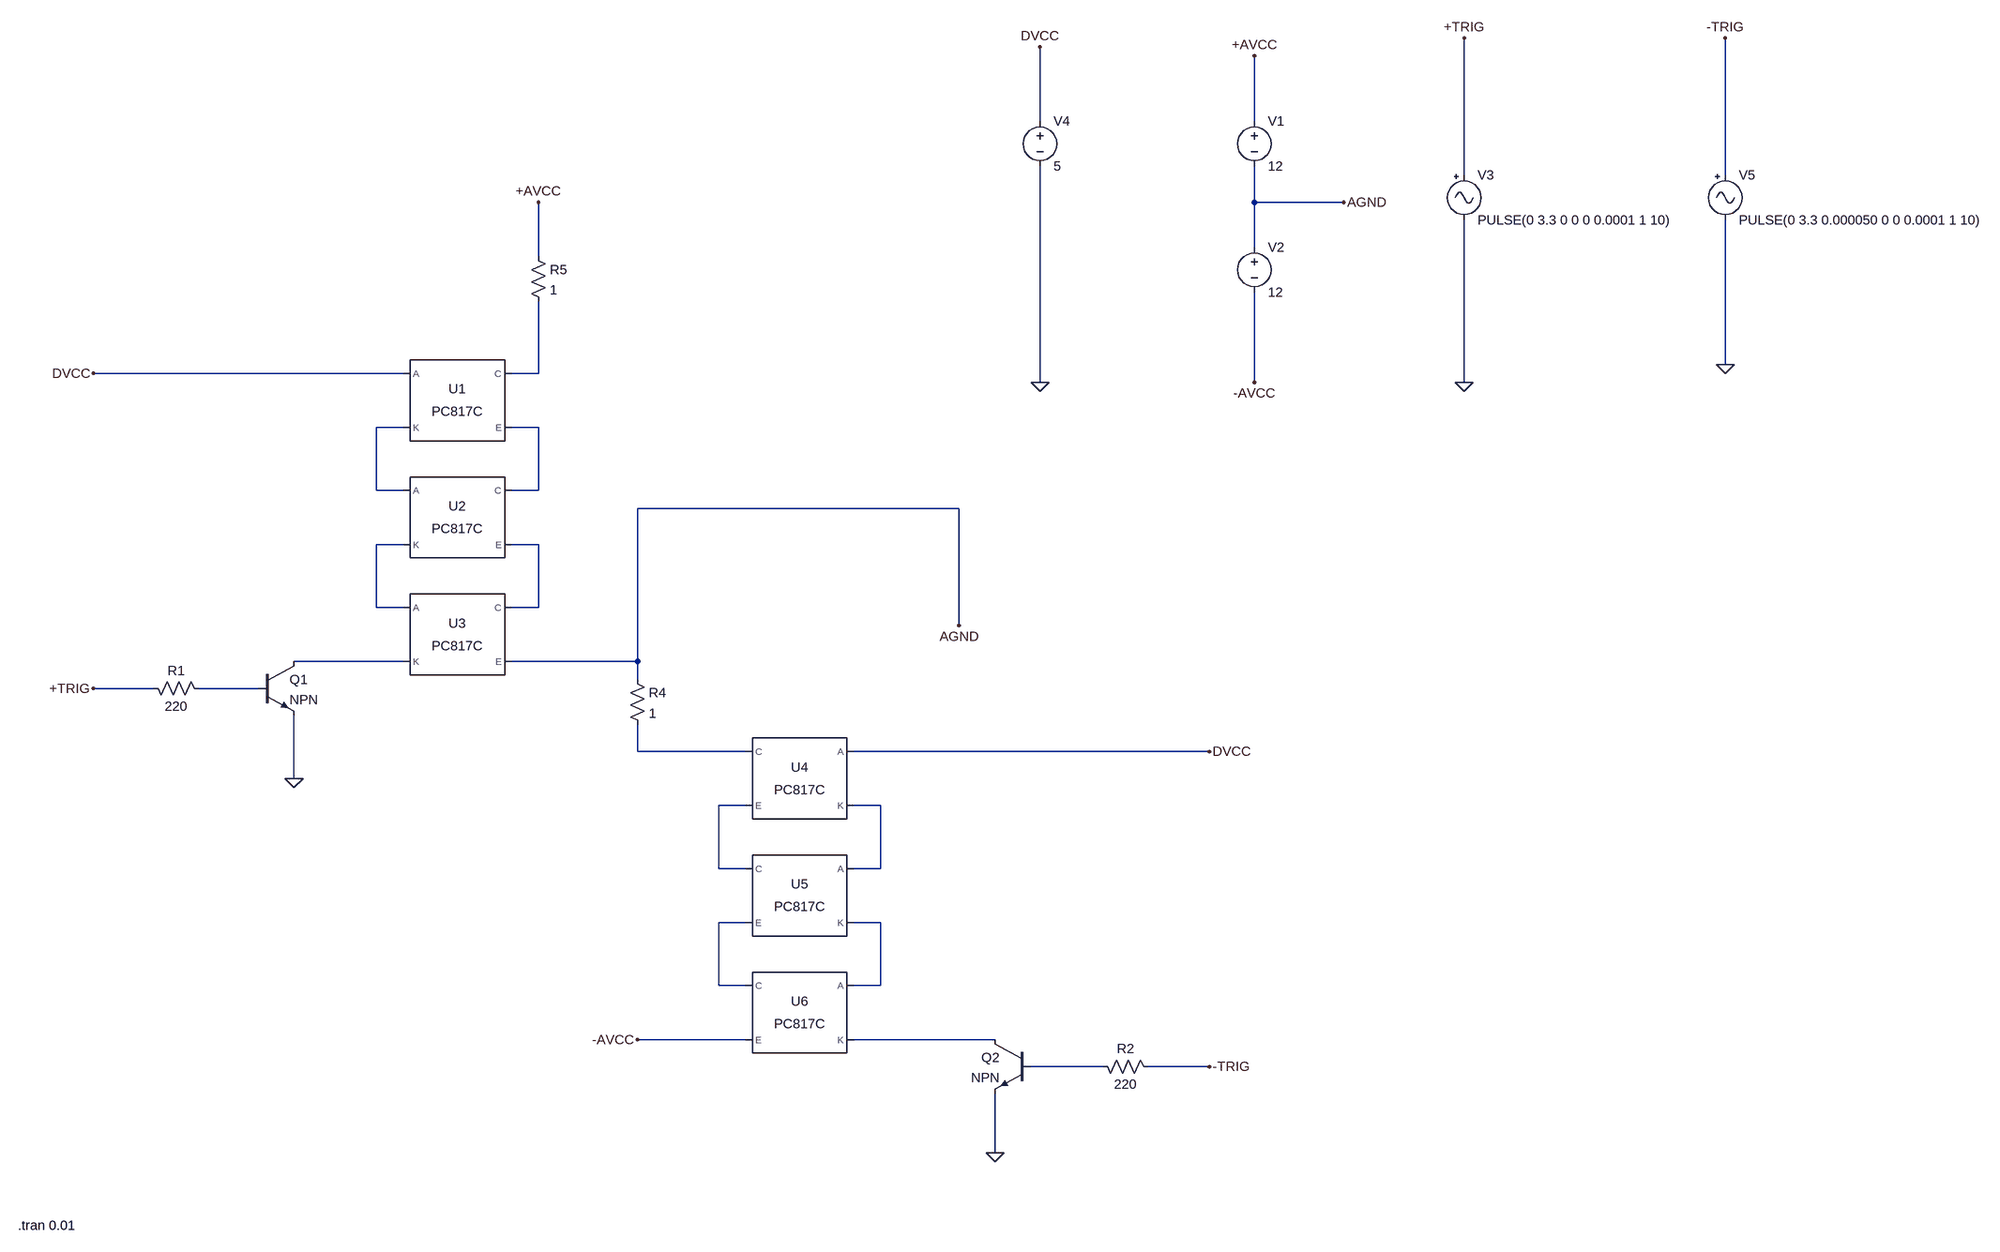
[diagram p0: schematic circuit_simulation.asc]
circuit_simulation.asc, the LTspice schematic file:
Version 4
SHEET 1 3124 1636
WIRE 1184 -352 1184 -496
WIRE 1600 -352 1600 -480
WIRE 2176 -256 2176 -512
WIRE 2640 -256 2640 -512
WIRE 1600 -208 1600 -272
WIRE 1824 -208 1600 -208
WIRE 1600 -128 1600 -208
WIRE 288 -112 288 -208
WIRE 2640 80 2640 -176
WIRE 48 96 -576 96
WIRE 288 96 288 -32
WIRE 288 96 240 96
WIRE 1184 112 1184 -272
WIRE 1600 112 1600 -48
WIRE 2176 112 2176 -176
WIRE 48 192 0 192
WIRE 288 192 240 192
WIRE 0 304 0 192
WIRE 48 304 0 304
WIRE 288 304 288 192
WIRE 288 304 240 304
WIRE 1040 336 464 336
WIRE 48 400 0 400
WIRE 288 400 240 400
WIRE 0 512 0 400
WIRE 48 512 0 512
WIRE 288 512 288 400
WIRE 288 512 240 512
WIRE 1040 544 1040 336
WIRE 48 608 -208 608
WIRE 464 608 464 336
WIRE 464 608 240 608
WIRE 464 640 464 608
WIRE -464 656 -576 656
WIRE -272 656 -384 656
WIRE 464 768 464 720
WIRE 656 768 464 768
WIRE 1520 768 848 768
WIRE -208 816 -208 704
WIRE 656 864 608 864
WIRE 896 864 848 864
WIRE 608 976 608 864
WIRE 656 976 608 976
WIRE 896 976 896 864
WIRE 896 976 848 976
WIRE 656 1072 608 1072
WIRE 896 1072 848 1072
WIRE 608 1184 608 1072
WIRE 656 1184 608 1184
WIRE 896 1184 896 1072
WIRE 896 1184 848 1184
WIRE 656 1280 464 1280
WIRE 1104 1280 848 1280
WIRE 1296 1328 1168 1328
WIRE 1520 1328 1376 1328
WIRE 1104 1488 1104 1376
FLAG 1520 768 DVCC
FLAG -576 96 DVCC
FLAG 288 -208 +AVCC
FLAG 464 1280 -AVCC
FLAG -576 656 +TRIG
FLAG 1520 1328 -TRIG
FLAG 1600 -480 +AVCC
FLAG 1600 112 -AVCC
FLAG 1824 -208 AGND
FLAG 1040 544 AGND
FLAG 2176 112 0
FLAG 1104 1488 0
FLAG -208 816 0
FLAG 2176 -512 +TRIG
FLAG 1184 -496 DVCC
FLAG 1184 112 0
FLAG 2640 -512 -TRIG
FLAG 2640 80 0
SYMBOL Optos\\PC817C 144 144 R0
SYMATTR InstName U1
SYMBOL Optos\\PC817C 144 352 R0
SYMATTR InstName U2
SYMBOL Optos\\PC817C 144 560 R0
SYMATTR InstName U3
SYMBOL Optos\\PC817C 752 816 M0
SYMATTR InstName U4
SYMBOL Optos\\PC817C 752 1024 M0
SYMATTR InstName U5
SYMBOL Optos\\PC817C 752 1232 M0
SYMATTR InstName U6
SYMBOL npn -272 608 R0
SYMATTR InstName Q1
SYMBOL res -480 640 M90
WINDOW 0 0 56 VBottom 2
WINDOW 3 32 56 VTop 2
SYMATTR InstName R1
SYMATTR Value 220
SYMBOL npn 1168 1280 M0
SYMATTR InstName Q2
SYMBOL res 1280 1312 M90
WINDOW 0 0 56 VBottom 2
WINDOW 3 32 56 VTop 2
SYMATTR InstName R2
SYMATTR Value 220
SYMBOL voltage 1600 -368 R0
WINDOW 123 0 0 Left 0
WINDOW 39 0 0 Left 0
SYMATTR InstName V1
SYMATTR Value 12
SYMBOL voltage 1600 -144 R0
WINDOW 123 0 0 Left 0
WINDOW 39 0 0 Left 0
SYMATTR InstName V2
SYMATTR Value 12
SYMBOL Misc\\signal 2176 -272 R0
WINDOW 123 0 0 Left 0
WINDOW 39 0 0 Left 0
SYMATTR InstName V3
SYMATTR Value PULSE(0 3.3 0 0 0 0.0001 1 10)
SYMBOL res 448 624 R0
SYMATTR InstName R4
SYMATTR Value 1
SYMBOL res 272 -128 R0
SYMATTR InstName R5
SYMATTR Value 1
SYMBOL voltage 1184 -368 R0
WINDOW 123 0 0 Left 0
WINDOW 39 0 0 Left 0
SYMATTR InstName V4
SYMATTR Value 5
SYMBOL Misc\\signal 2640 -272 R0
WINDOW 123 0 0 Left 0
WINDOW 39 0 0 Left 0
SYMATTR InstName V5
SYMATTR Value PULSE(0 3.3 0.000050 0 0 0.0001 1 10)
TEXT -710 1620 Left 2 !.tran 0.01

The netlist it stands for:
* circuit_simulation.asc
XU1 DVCC N002 N001 N003 PC817 Igain=2.3m  ; PC817C, pins A K C E
XU2 N002 N004 N003 N005 PC817 Igain=2.3m  ; PC817C, pins A K C E
XU3 N004 N006 N005 AGND PC817 Igain=2.3m  ; PC817C, pins A K C E
XU4 DVCC N010 N008 N009 PC817 Igain=2.3m  ; PC817C, pins A K C E
XU5 N010 N012 N009 N011 PC817 Igain=2.3m  ; PC817C, pins A K C E
XU6 N012 N013 N011 -AVCC PC817 Igain=2.3m  ; PC817C, pins A K C E
Q1 N006 N007 0 0 NPN
R1 +TRIG N007 220
Q2 N013 N014 0 0 NPN
R2 N014 -TRIG 220
V1 +AVCC AGND 12
V2 AGND -AVCC 12
V3 +TRIG 0 PULSE(0 3.3 0 0 0 0.0001 1 10)
R4 AGND N008 1
R5 +AVCC N001 1
V4 DVCC 0 5
V5 -TRIG 0 PULSE(0 3.3 0.000050 0 0 0.0001 1 10)
.model NPN NPN
.model PNP PNP
.lib standard.bjt
.tran 0.01
.lib PC817.sub
.backanno
.end